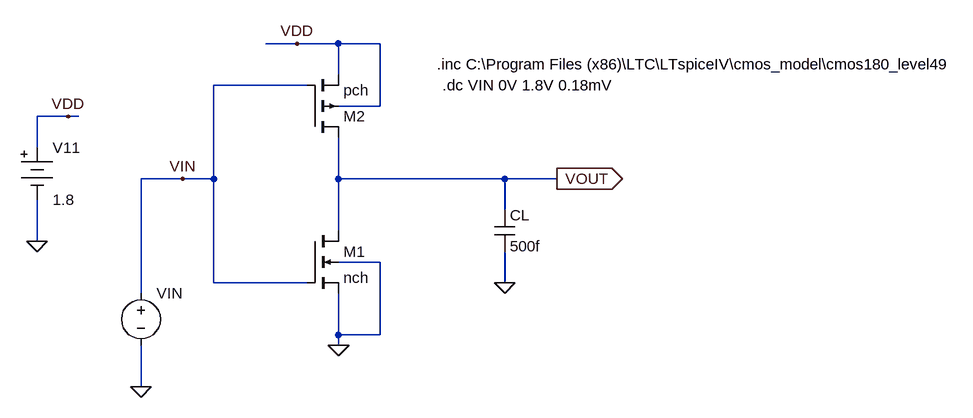
[diagram p0: schematic lab2-1.asc]
lab2-1.asc, the LTspice schematic file:
Version 4
SHEET 1 1700 948
WIRE 544 -16 496 -16
WIRE 608 -16 544 -16
WIRE 672 -16 608 -16
WIRE 608 32 608 -16
WIRE 560 48 416 48
WIRE 672 80 672 -16
WIRE 672 80 608 80
WIRE 192 96 144 96
WIRE 208 96 192 96
WIRE 144 144 144 96
WIRE 368 192 304 192
WIRE 416 192 416 48
WIRE 416 192 368 192
WIRE 608 192 608 128
WIRE 864 192 608 192
WIRE 944 192 864 192
WIRE 864 240 864 192
WIRE 608 272 608 192
WIRE 144 288 144 224
WIRE 672 320 608 320
WIRE 416 352 416 192
WIRE 560 352 416 352
WIRE 864 352 864 304
WIRE 304 368 304 192
WIRE 608 432 608 368
WIRE 672 432 672 320
WIRE 672 432 608 432
WIRE 608 448 608 432
WIRE 304 512 304 448
FLAG 144 288 0
FLAG 192 96 VDD
FLAG 944 192 VOUT
IOPIN 944 192 Out
FLAG 864 352 0
FLAG 608 448 0
FLAG 544 -16 VDD
FLAG 304 512 0
FLAG 368 192 VIN
SYMBOL Misc\\battery 144 128 R0
WINDOW 123 0 0 Left 2
WINDOW 39 0 0 Left 2
SYMATTR InstName V11
SYMATTR Value 1.8
SYMBOL nmos4 560 272 R0
SYMATTR InstName M1
SYMATTR Value nch
SYMATTR Value2 l=0.18u w=5u
SYMBOL cap 848 240 R0
SYMATTR InstName CL
SYMATTR Value 500f
SYMBOL pmos4 560 128 M180
SYMATTR InstName M2
SYMATTR Value pch
SYMATTR Value2 l=0.18u w=12.5u
SYMBOL voltage 304 352 R0
WINDOW 123 0 0 Left 2
WINDOW 39 0 0 Left 2
SYMATTR InstName VIN
SYMATTR Value ""
TEXT 760 16 Left 2 !.inc C:\\Program Files (x86)\\LTC\\LTspiceIV\\cmos_model\\cmos180_level49
TEXT 768 48 Left 2 !.dc VIN 0V 1.8V 0.18mV

The netlist it stands for:
* lab2-1.asc
V11 VDD 0 1.8
M1 VOUT VIN 0 0 nch l=0.18u w=5u
CL VOUT 0 500f
M2 VOUT VIN VDD VDD pch l=0.18u w=12.5u
VIN VIN 0
.model NMOS NMOS
.model PMOS PMOS
.lib standard.mos
.inc C:\Program Files (x86)\LTC\LTspiceIV\cmos_model\cmos180_level49
.dc VIN 0V 1.8V 0.18mV
.backanno
.end

* Results of the author's LTspice run, read from the files saved beside the schematic
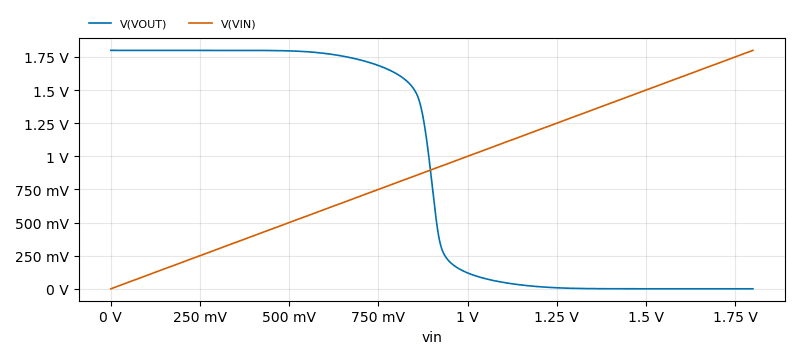
[diagram p1: DC transfer characteristic of lab2-1.asc, plotted from the saved traces]
* DC transfer characteristic, 1 run:
*   V(VOUT): 1.8 V at vin=0 V, 13.76 nV at vin=1.8 V, min 13.76 nV, max 1.8 V
*   V(VIN): 0 V at vin=0 V, 1.8 V at vin=1.8 V, min 0 V, max 1.8 V